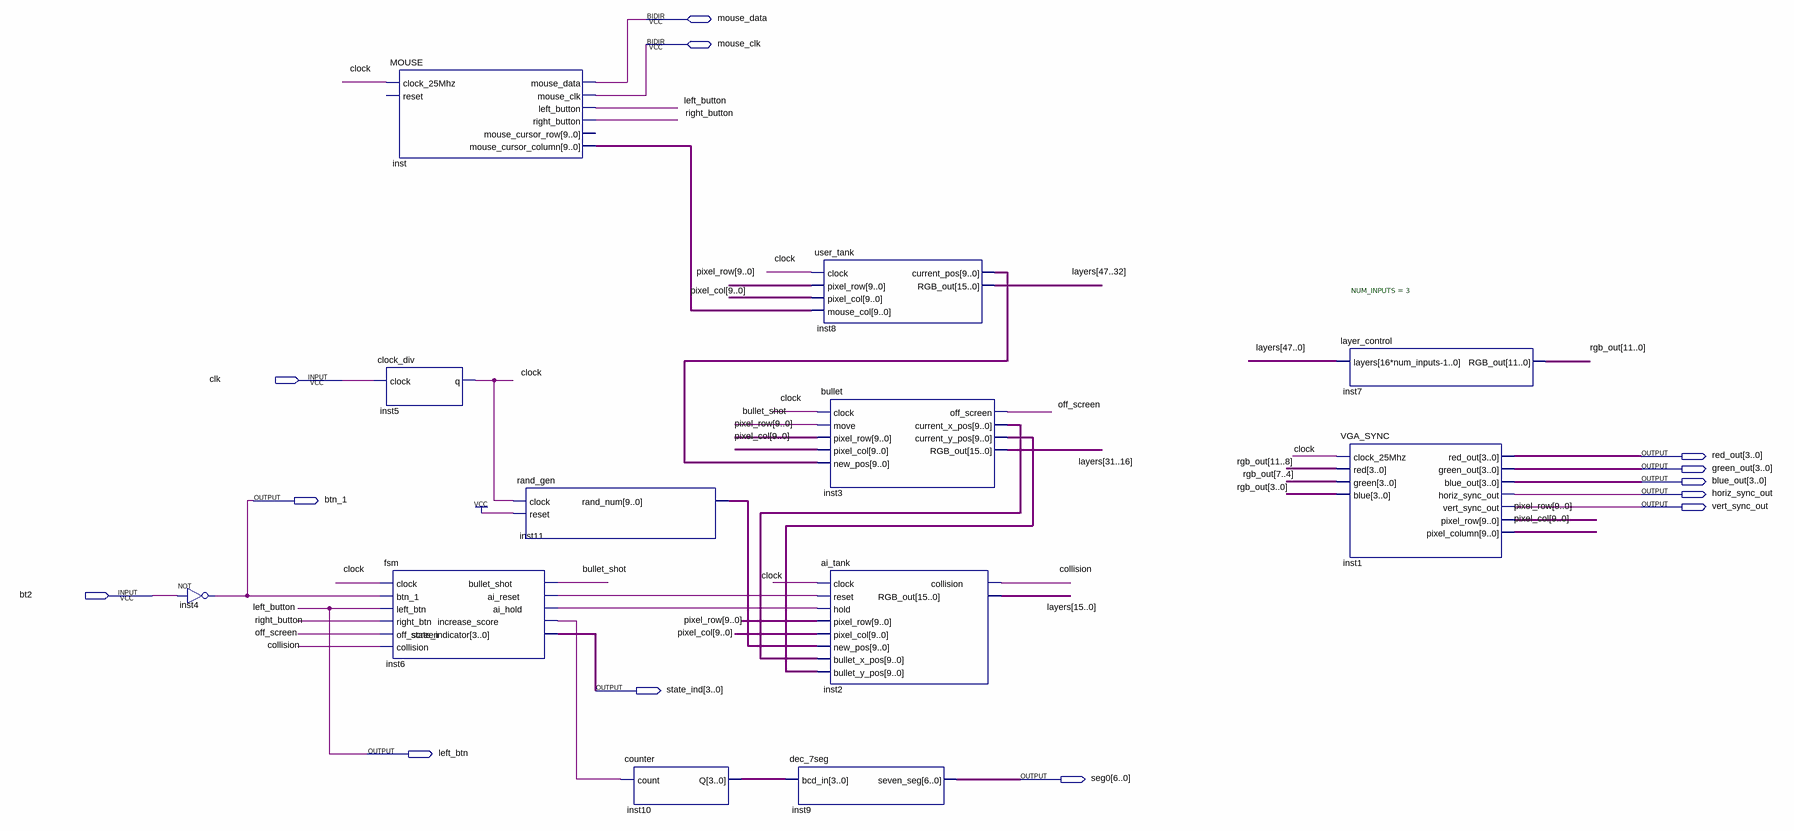
[diagram p0: schematic sheet]
// Quartus schematic cs305_project.bdf as structural Verilog: 12 symbols, 13 pins
module cs305_project (
  input  clk,
  input  bt2,
  inout  mouse_data,
  inout  mouse_clk,
  output [3:0] red_out,
  output [3:0] green_out,
  output [3:0] blue_out,
  output horiz_sync_out,
  output btn_1,
  output vert_sync_out,
  output [3:0] state_ind,
  output left_btn,
  output [6:0] seg0
);

  wire bullet_shot, clock, collision, inst6_ai_hold, inst6_ai_reset, inst6_increase_score, off_screen,
       right_button;
  wire [3:0] inst10_q;
  wire [9:0] inst3_current_x_pos, inst3_current_y_pos, inst8_current_pos, inst11_rand_num,
       inst_mouse_cursor_column, pixel_col, pixel_row;
  wire [11:0] rgb_out;
  wire [47:0] layers;

  not inst4 (btn_1, bt2);
  MOUSE inst (
    .clock_25Mhz(clock), .left_button(left_btn), .right_button(right_button),
    .mouse_cursor_column(inst_mouse_cursor_column), .mouse_data(mouse_data), .mouse_clk(mouse_clk));  // open: reset, mouse_cursor_row
  clock_div inst5 (.clock(clk), .q(clock));
  fsm inst6 (
    .clock(clock), .btn_1(btn_1), .left_btn(left_btn), .right_btn(right_button), .off_screen(off_screen),
    .collision(collision), .bullet_shot(bullet_shot), .ai_reset(inst6_ai_reset), .ai_hold(inst6_ai_hold),
    .increase_score(inst6_increase_score), .state_indicator(state_ind));
  rand_gen inst11 (.clock(clock), .reset(1'b1), .rand_num(inst11_rand_num));
  counter inst10 (.count(inst6_increase_score), .Q(inst10_q));
  dec_7seg inst9 (.bcd_in(inst10_q), .seven_seg(seg0));
  user_tank inst8 (
    .clock(clock), .pixel_row(pixel_row), .pixel_col(pixel_col), .mouse_col(inst_mouse_cursor_column),
    .current_pos(inst8_current_pos), .RGB_out(layers[47:32]));
  bullet inst3 (
    .clock(clock), .move(bullet_shot), .pixel_row(pixel_row), .pixel_col(pixel_col),
    .new_pos(inst8_current_pos), .off_screen(off_screen), .current_x_pos(inst3_current_x_pos),
    .current_y_pos(inst3_current_y_pos), .RGB_out(layers[31:16]));
  ai_tank inst2 (
    .clock(clock), .reset(inst6_ai_reset), .hold(inst6_ai_hold), .pixel_row(pixel_row),
    .pixel_col(pixel_col), .new_pos(inst11_rand_num), .bullet_x_pos(inst3_current_x_pos),
    .bullet_y_pos(inst3_current_y_pos), .collision(collision), .RGB_out(layers[15:0]));
  layer_control #(.NUM_INPUTS(3)) inst7 (.layers(layers), .RGB_out(rgb_out));
  VGA_SYNC inst1 (
    .clock_25Mhz(clock), .red(rgb_out[11:8]), .green(rgb_out[7:4]), .blue(rgb_out[3:0]), .red_out(red_out),
    .green_out(green_out), .blue_out(blue_out), .horiz_sync_out(horiz_sync_out),
    .vert_sync_out(vert_sync_out), .pixel_row(pixel_row), .pixel_column(pixel_col));

  // Other names for the same wires on the sheet: left_button = left_btn
endmodule
